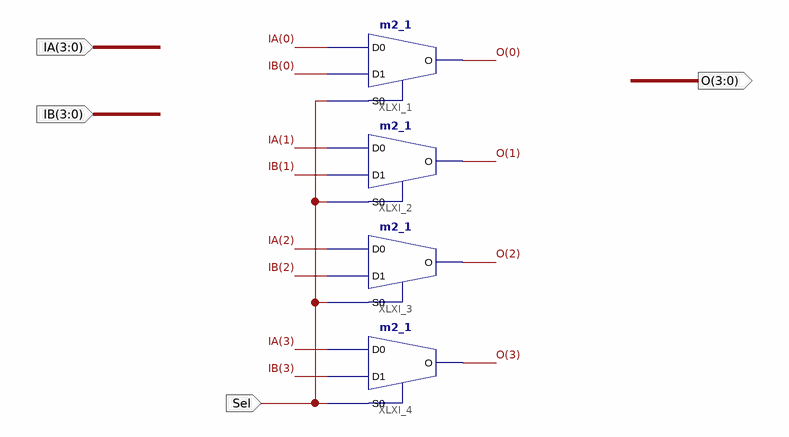
[diagram p0: schematic sheet 1]
// Xilinx ISE schematic mux4b2.sch (spartan3e) as structural Verilog: 4 symbols, 4 ports
module mux4b2 (
  input  Sel,
  input  [3:0] IA,
  input  [3:0] IB,
  output [3:0] O
);

  m2_1 XLXI_1 (.D0(IA[0]), .D1(IB[0]), .S0(Sel), .O(O[0]));
  m2_1 XLXI_2 (.D0(IA[1]), .D1(IB[1]), .S0(Sel), .O(O[1]));
  m2_1 XLXI_3 (.D0(IA[2]), .D1(IB[2]), .S0(Sel), .O(O[2]));
  m2_1 XLXI_4 (.D0(IA[3]), .D1(IB[3]), .S0(Sel), .O(O[3]));
endmodule
